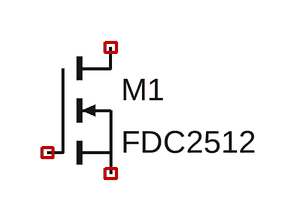
[diagram p0: schematic Draft1.asc]
Draft1.asc, the LTspice schematic file:
Version 4
SHEET 1 880 680
SYMBOL nmos 64 112 R0
SYMATTR InstName M1
SYMATTR Value FDC2512

The netlist it stands for:
* Draft1.asc
M1 NC_01 NC_02 NC_03 NC_03 FDC2512
.model NMOS NMOS
.model PMOS PMOS
.lib standard.mos
.backanno
.end